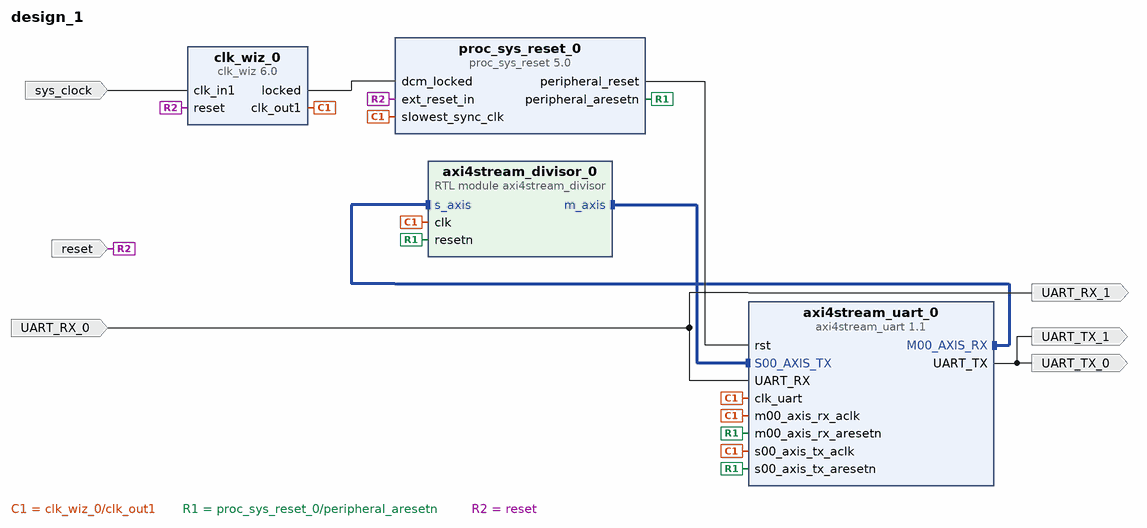
[diagram p0: block diagram of the top level]
# Vivado block design design_1, xc7a35tcpg236-1, Vivado 2020.2
create_bd_design design_1

create_bd_port -dir I -type clk sys_clock
set_property -dict {CONFIG.FREQ_HZ 100000000 CONFIG.PHASE 0.000} [get_bd_ports sys_clock]
create_bd_port -dir I -type rst reset
set_property -dict {CONFIG.POLARITY ACTIVE_HIGH} [get_bd_ports reset]
create_bd_port -dir O UART_TX_0
create_bd_port -dir I UART_RX_0
create_bd_port -dir O UART_TX_1
create_bd_port -dir O UART_RX_1

create_bd_cell -type ip -vlnv xilinx.com:ip:clk_wiz:6.0 clk_wiz_0
set_property -dict [list \
  CONFIG.CLK_IN1_BOARD_INTERFACE sys_clock \
  CONFIG.RESET_BOARD_INTERFACE reset \
  CONFIG.USE_BOARD_FLOW true \
] [get_bd_cells clk_wiz_0]
create_bd_cell -type ip -vlnv xilinx.com:ip:proc_sys_reset:5.0 proc_sys_reset_0
create_bd_cell -type ip -vlnv DigiLAB:ip:axi4stream_uart:1.1 axi4stream_uart_0
set_property -dict [list \
  CONFIG.UART_BAUD_RATE 115200 \
  CONFIG.UART_BOARD_INTERFACE usb_uart \
  CONFIG.USE_BOARD_FLOW true \
] [get_bd_cells axi4stream_uart_0]
create_bd_cell -type module -reference axi4stream_divisor axi4stream_divisor_0

# ---- connections ----

connect_bd_intf_net [get_bd_intf_pins axi4stream_divisor_0/m_axis] [get_bd_intf_pins axi4stream_uart_0/S00_AXIS_TX]
connect_bd_intf_net [get_bd_intf_pins axi4stream_uart_0/M00_AXIS_RX] [get_bd_intf_pins axi4stream_divisor_0/s_axis]
connect_bd_net [get_bd_ports sys_clock] [get_bd_pins clk_wiz_0/clk_in1]
connect_bd_net [get_bd_pins clk_wiz_0/clk_out1] \
  [get_bd_pins proc_sys_reset_0/slowest_sync_clk] [get_bd_pins axi4stream_uart_0/clk_uart] \
  [get_bd_pins axi4stream_uart_0/m00_axis_rx_aclk] [get_bd_pins axi4stream_uart_0/s00_axis_tx_aclk] \
  [get_bd_pins axi4stream_divisor_0/clk]
connect_bd_net [get_bd_pins clk_wiz_0/locked] [get_bd_pins proc_sys_reset_0/dcm_locked]
connect_bd_net [get_bd_pins proc_sys_reset_0/peripheral_reset] [get_bd_pins axi4stream_uart_0/rst]
connect_bd_net [get_bd_pins proc_sys_reset_0/peripheral_aresetn] \
  [get_bd_pins axi4stream_uart_0/m00_axis_rx_aresetn] [get_bd_pins axi4stream_uart_0/s00_axis_tx_aresetn] \
  [get_bd_pins axi4stream_divisor_0/resetn]
connect_bd_net [get_bd_ports reset] [get_bd_pins clk_wiz_0/reset] [get_bd_pins proc_sys_reset_0/ext_reset_in]
connect_bd_net [get_bd_pins axi4stream_uart_0/UART_TX] [get_bd_ports UART_TX_0] [get_bd_ports UART_TX_1]
connect_bd_net -net UART_RX_0_1 [get_bd_ports UART_RX_0] [get_bd_pins axi4stream_uart_0/UART_RX] [get_bd_ports UART_RX_1]

validate_bd_design
save_bd_design
